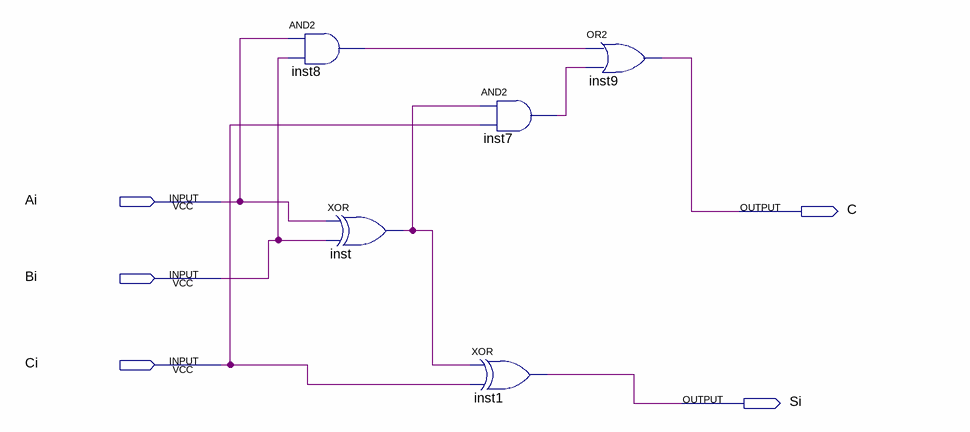
[diagram p0: schematic sheet]
// Quartus schematic ful_adder_1bit.bdf as structural Verilog: 5 symbols, 5 pins
module ful_adder_1bit (
  input  Ai,
  input  Bi,
  input  Ci,
  output C,
  output Si
);

  wire inst7_out, inst8_out, inst_out;

  and inst8 (inst8_out, Ai, Bi);
  xor inst (inst_out, Ai, Bi);
  xor inst1 (Si, inst_out, Ci);
  and inst7 (inst7_out, inst_out, Ci);
  or inst9 (C, inst8_out, inst7_out);
endmodule
